# Altium project BatteryMonitor.PrjPCB
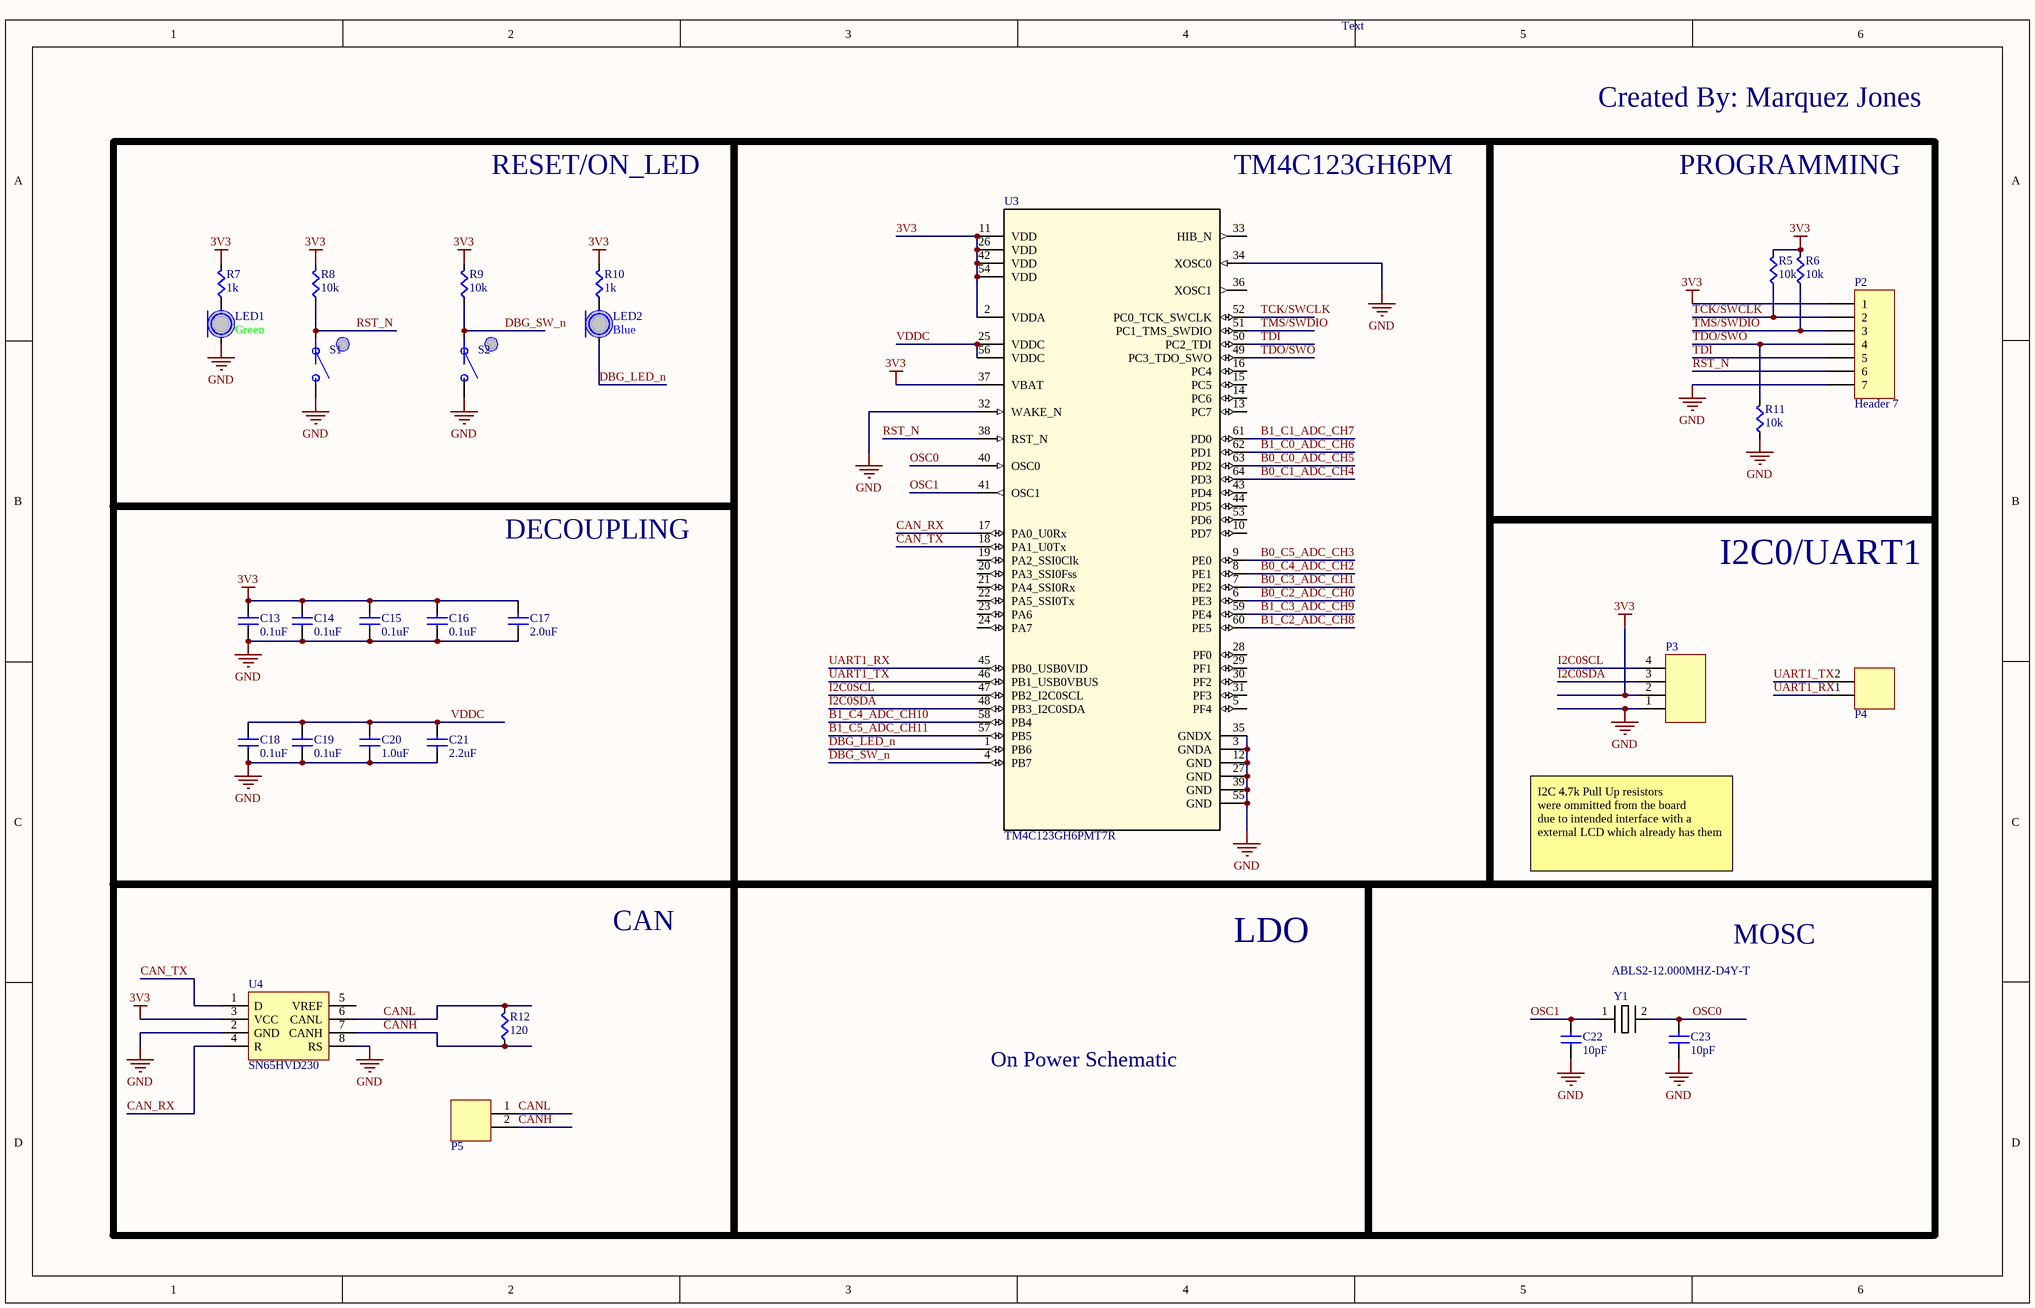
[diagram p0: Tiva_C_Base.SchDoc]
3 sheets, 106 parts. Net scope: global (net labels, ports and power ports of the same name join across sheets).
Board file: BattBoard.PcbDoc
Sheets:
  Tiva_C_Base.SchDoc
  Batt_Op_Amp.SchDoc
  Power.SchDoc

## Sheet Tiva_C_Base.SchDoc
size B

### Parts
C13  value 0.1uF  [CAPC0603]  (hidden comment: Cap)
C14  value 0.1uF  [CAPC0603]  (hidden comment: Cap)
C15  value 0.1uF  [CAPC0603]  (hidden comment: Cap)
C16  value 0.1uF  [CAPC0603]  (hidden comment: Cap)
C17  value 2.0uF  [CAPC0603]  (hidden comment: Cap)
C18  value 0.1uF  [CAPC0603]  (hidden comment: Cap)
C19  value 0.1uF  [CAPC0603]  (hidden comment: Cap)
C20  value 1.0uF  [CAPC0603]  (hidden comment: Cap)
C21  value 2.2uF  [CAPC0603]  (hidden comment: Cap)
C22  value 10pF  [CAPC0603]  (hidden comment: Cap)
C23  value 10pF  [CAPC0603]  (hidden comment: Cap)
LED1  Color: Green  [LED0603]  (hidden comment: LED)
LED2  Color: Blue  [LED0603]  (hidden comment: LED)
P2  Header 7  [HDR1X7]
P3  (no value)  [MOLEX-HDR-1X4-SHERLOCK-VERT]
P4  2-pin Vert Sherlock  [MOLEX-HDR-1X2-SHERLOCK-VERT]  (value not drawn)
P5  2-pin Vert Sherlock  [MOLEX-HDR-1X2-SHERLOCK-VERT]  (value not drawn)
R5  value 10k  [RES0603]  (hidden comment: Res)
R6  value 10k  [RES0603]  (hidden comment: Res)
R7  value 1k  [RES0603]  (hidden comment: Res)
R8  value 10k  [RES0603]  (hidden comment: Res)
R9  value 10k  [RES0603]  (hidden comment: Res)
R10  value 1k  [RES0603]  (hidden comment: Res)
R11  value 10k  [RES0603]  (hidden comment: Res)
R12  value 120  [RES0603]  (hidden comment: Res)
S1  Button  [PTS645xxxxSMTR92]  (value not drawn)
S2  Button  [PTS645xxxxSMTR92]  (value not drawn)
U3  TM4C123GH6PMT7R  [TM4C123GH6PMT7R_L]
U4  SN65HVD230  [SOIC-8pin]
Y1  ABLS2-12.000MHZ-D4Y-T  [HC49/US]

### Blocks framed on the sheet
RESET/ON_LED: LED1 LED2 R7-R10 S1 S2
TM4C123GH6PM: U3
PROGRAMMING: P2 R5 R6 R11
DECOUPLING: C13-C21
I2C0/UART1: P3 P4
CAN: P5 R12 U4
MOSC: C22 C23 Y1

### Nets
3V3: C13.1(A) C14.1(A) C15.1(A) C16.1(A) C17.1(A) P2.1 P3.2 R5.1(A) R6.1(A) R7.1(A) R8.1(A) R9.1(A) R10.1(A) U3.2(VDDA) U3.11(VDD) U3.26(VDD) U3.37(VBAT) U3.42(VDD) U3.54(VDD) U4.3(VCC)
GND: C13.2(B) C14.2(B) C15.2(B) C16.2(B) C17.2(B) C18.2(B) C19.2(B) C20.2(B) C21.2(B) C22.2(B) C23.2(B) LED1.C P2.7 P3.1 R11.2(B) S1.B S2.B U3.3(GNDA) U3.12(GND) U3.27(GND) U3.32(WAKE_N) U3.34(XOSC0) U3.35(GNDX) U3.39(GND) U3.55(GND) U4.2(GND) U4.8(RS)
B0_C0_ADC_CH5: U3.63(PD2)
B0_C1_ADC_CH4: U3.64(PD3)
B0_C2_ADC_CH0: U3.6(PE3)
B0_C3_ADC_CH1: U3.7(PE2)
B0_C4_ADC_CH2: U3.8(PE1)
B0_C5_ADC_CH3: U3.9(PE0)
B1_C0_ADC_CH6: U3.62(PD1)
B1_C1_ADC_CH7: U3.61(PD0)
B1_C2_ADC_CH8: U3.60(PE5)
B1_C3_ADC_CH9: U3.59(PE4)
B1_C4_ADC_CH10: U3.58(PB4)
B1_C5_ADC_CH11: U3.57(PB5)
CAN_RX: U3.17(PA0_U0Rx) U4.4(R)
CAN_TX: U3.18(PA1_U0Tx) U4.1(D)
CANH: P5.2 R12.2(B) U4.7(CANH)
CANL: P5.1 R12.1(A) U4.6(CANL)
DBG_LED_n: LED2.C U3.1(PB6)
DBG_SW_n: R9.2(B) S2.A U3.4(PB7)
I2C0SCL: P3.4 U3.47(PB2_I2C0SCL)
I2C0SDA: P3.3 U3.48(PB3_I2C0SDA)
OSC0: C23.1(A) U3.40(OSC0) Y1.2
OSC1: C22.1(A) U3.41(OSC1) Y1.1
RST_N: P2.6 R8.2(B) S1.A U3.38(RST_N)
TCK/SWCLK: P2.2 R5.2(B) U3.52(PC0_TCK_SWCLK)
TDI: P2.5 U3.50(PC2_TDI)
TDO/SWO: P2.4 R11.1(A) U3.49(PC3_TDO_SWO)
TMS/SWDIO: P2.3 R6.2(B) U3.51(PC1_TMS_SWDIO)
UART1_RX: P4.1 U3.45(PB0_USB0VID)
UART1_TX: P4.2 U3.46(PB1_USB0VBUS)
VDDC: C18.1(A) C19.1(A) C20.1(A) C21.1(A) U3.25(VDDC) U3.56(VDDC)
NetLED1_A: LED1.A R7.2(B)
NetLED2_A: LED2.A R10.2(B)

Not connected (* = marked no-connect by the designer): U3 5(PF4) 10(PD7) 13(PC7) 14(PC6) 15(PC5) 16(PC4) 19(PA2_SSI0Clk) 20(PA3_SSI0Fss) 21(PA4_SSI0Rx) 22(PA5_SSI0Tx) 23(PA6) 24(PA7) 28(PF0) 29(PF1) 30(PF2) 31(PF3) 33(HIB_N) 36(XOSC1) 43(PD4) 44(PD5) 53(PD6); U4 5(VREF)

### Notes on the sheet
- Text
- Created By: Marquez Jones
- I2C 4.7k Pull Up resistors
  were ommitted from the board
  due to intended interface with a
  external LCD which already has them
- LDO
- On Power Schematic

### Library data of the parts
P2 = Header 7: Header, 7-Pin; LatestRevisionDate: 17-Jul-2002; LatestRevisionNote: Re-released for DXP Platform.; Publisher: Altium Limited
P3 = MOLEX-HDR-1x4-SHERLOCK_VERT: Header, Molex, 2mm Pitch Sherlock Header, Single Row, Vertical, 4 Circuits, Length 3.3mm, 0353620450; Manufacturer Part Number: *; Order Part Number: *
P4 P5 = MOLEX-HDR-1x2-SHERLOCK_VERT: Header, Molex, 2mm Pitch Sherlock Header, Single Row, Vertical, 2 Circuits, Length 3.3mm, 0353620250; Manufacturer Part Number: *; Order Part Number: *
S1 S2 = Button: SPST Button; Supplier 1: Digi-Key; Supplier Part Number 1: CKN9087CT-ND
U3 = TM4C123GH6PMT7R: Imported; PartNumber: TM4C123GH6PMTR; Manufacturer: Texas Instruments; CompType: IC; PIN_COUNT: 64; Application_BuildNumber: *; Alternate_PartNumber: TM4C123GH6PMT; PackageReference: PM0064A; MountType: SMT; RoHS: Y; RefDes: RefDes; TYPE: TYPE; Value: Value
U4 = SN65HVD230: 3.3V CAN Bus Transceiver
Y1 = ABLS2-12.000MHZ-D4Y-T: 12MHz ±30ppm Crystal 18pF 50 Ohm -40°C ~ 85°C Surface Mount HC49/US; Supplier 1: Digi-Key; Supplier Part Number 1: 535-9869-1-ND
C13-C23 = Cap: Supplier 1: Digi-Key; Supplier Part Number 1: 1276-1000-1-ND
LED1 LED2 = LED: Supplier 1: Digi-Key; Supplier Part Number 1: 754-1122-1-ND
R5-R12 = Res: Supplier 1: Digi-Key; Supplier Part Number 1: RMCF0603JT10K0CT-ND

## Sheet Batt_Op_Amp.SchDoc
size C
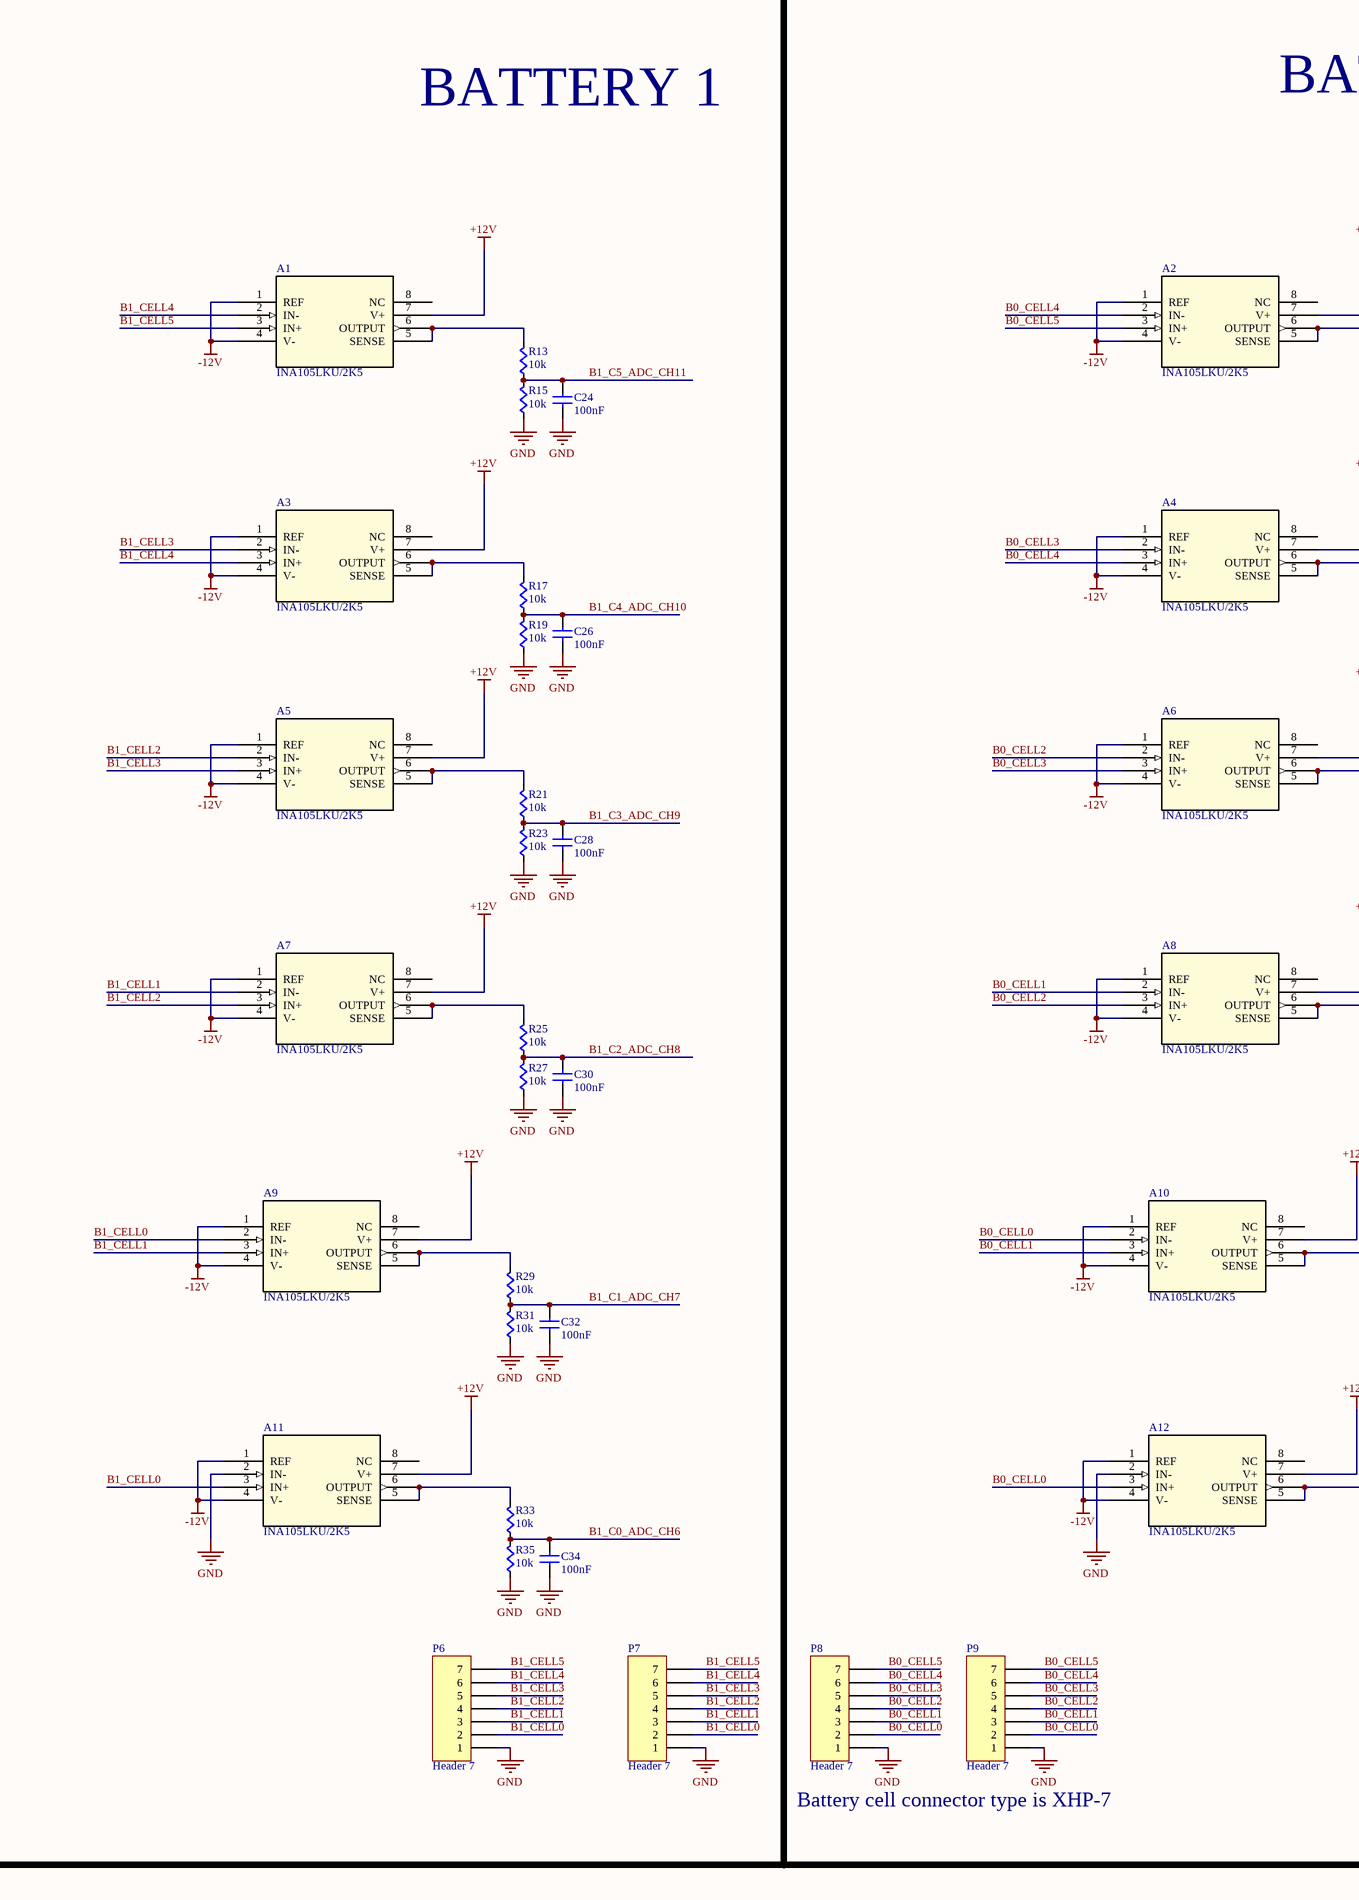
[diagram p1: Batt_Op_Amp.SchDoc, left]
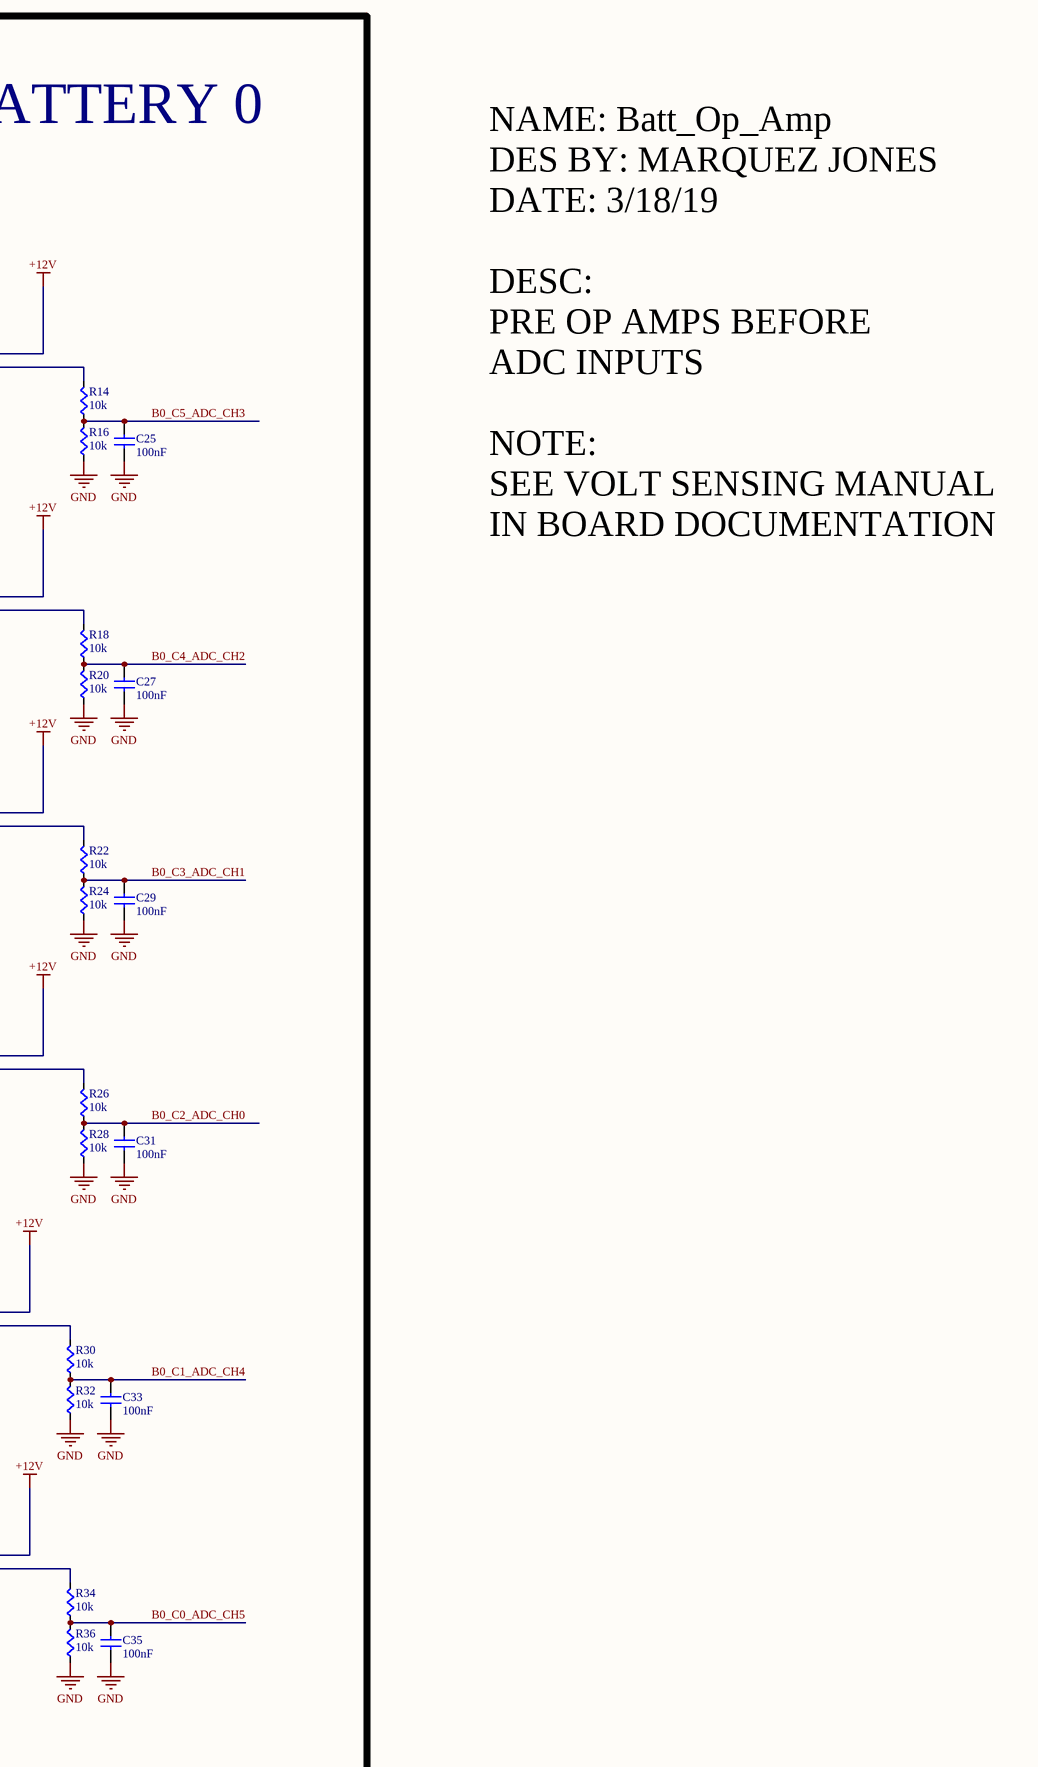
[diagram p2: Batt_Op_Amp.SchDoc, right]

### Parts
A1  INA105LKU/2K5  [SOIC-8N]
A2  INA105LKU/2K5  [SOIC-8N]
A3  INA105LKU/2K5  [SOIC-8N]
A4  INA105LKU/2K5  [SOIC-8N]
A5  INA105LKU/2K5  [SOIC-8N]
A6  INA105LKU/2K5  [SOIC-8N]
A7  INA105LKU/2K5  [SOIC-8N]
A8  INA105LKU/2K5  [SOIC-8N]
A9  INA105LKU/2K5  [SOIC-8N]
A10  INA105LKU/2K5  [SOIC-8N]
A11  INA105LKU/2K5  [SOIC-8N]
A12  INA105LKU/2K5  [SOIC-8N]
C24  value 100nF  [CAPC0603]  (hidden comment: Cap)
C25  value 100nF  [CAPC0603]  (hidden comment: Cap)
C26  value 100nF  [CAPC0603]  (hidden comment: Cap)
C27  value 100nF  [CAPC0603]  (hidden comment: Cap)
C28  value 100nF  [CAPC0603]  (hidden comment: Cap)
C29  value 100nF  [CAPC0603]  (hidden comment: Cap)
C30  value 100nF  [CAPC0603]  (hidden comment: Cap)
C31  value 100nF  [CAPC0603]  (hidden comment: Cap)
C32  value 100nF  [CAPC0603]  (hidden comment: Cap)
C33  value 100nF  [CAPC0603]  (hidden comment: Cap)
C34  value 100nF  [CAPC0603]  (hidden comment: Cap)
C35  value 100nF  [CAPC0603]  (hidden comment: Cap)
P6  Header 7  [HDR1X7]
P7  Header 7  [HDR1X7]
P8  Header 7  [HDR1X7]
P9  Header 7  [HDR1X7]
R13  value 10k  [RES0603]  (hidden comment: Res)
R14  value 10k  [RES0603]  (hidden comment: Res)
R15  value 10k  [RES0603]  (hidden comment: Res)
R16  value 10k  [RES0603]  (hidden comment: Res)
R17  value 10k  [RES0603]  (hidden comment: Res)
R18  value 10k  [RES0603]  (hidden comment: Res)
R19  value 10k  [RES0603]  (hidden comment: Res)
R20  value 10k  [RES0603]  (hidden comment: Res)
R21  value 10k  [RES0603]  (hidden comment: Res)
R22  value 10k  [RES0603]  (hidden comment: Res)
R23  value 10k  [RES0603]  (hidden comment: Res)
R24  value 10k  [RES0603]  (hidden comment: Res)
R25  value 10k  [RES0603]  (hidden comment: Res)
R26  value 10k  [RES0603]  (hidden comment: Res)
R27  value 10k  [RES0603]  (hidden comment: Res)
R28  value 10k  [RES0603]  (hidden comment: Res)
R29  value 10k  [RES0603]  (hidden comment: Res)
R30  value 10k  [RES0603]  (hidden comment: Res)
R31  value 10k  [RES0603]  (hidden comment: Res)
R32  value 10k  [RES0603]  (hidden comment: Res)
R33  value 10k  [RES0603]  (hidden comment: Res)
R34  value 10k  [RES0603]  (hidden comment: Res)
R35  value 10k  [RES0603]  (hidden comment: Res)
R36  value 10k  [RES0603]  (hidden comment: Res)

### Blocks framed on the sheet
BATTERY 1: A1 A3 A5 A7 A9 A11 C24 C26 C28 C30 C32 C34 P6 P7 R13 R15 R17 R19 R21 R23 R25 R27 R29 R31 R33 R35
BATTERY 0: A2 A4 A6 A8 A10 A12 C25 C27 C29 C31 C33 C35 P8 P9 R14 R16 R18 R20 R22 R24 R26 R28 R30 R32 R34 R36

### Nets
+12V: A1.7(V+) A2.7(V+) A3.7(V+) A4.7(V+) A5.7(V+) A6.7(V+) A7.7(V+) A8.7(V+) A9.7(V+) A10.7(V+) A11.7(V+) A12.7(V+)
-12V: A1.1(REF) A1.4(V-) A2.1(REF) A2.4(V-) A3.1(REF) A3.4(V-) A4.1(REF) A4.4(V-) A5.1(REF) A5.4(V-) A6.1(REF) A6.4(V-) A7.1(REF) A7.4(V-) A8.1(REF) A8.4(V-) A9.1(REF) A9.4(V-) A10.1(REF) A10.4(V-) A11.1(REF) A11.4(V-) A12.1(REF) A12.4(V-)
GND: A11.2(IN-) A12.2(IN-) C24.2(B) C25.2(B) C26.2(B) C27.2(B) C28.2(B) C29.2(B) C30.2(B) C31.2(B) C32.2(B) C33.2(B) C34.2(B) C35.2(B) P6.1 P7.1 P8.1 P9.1 R15.2(B) R16.2(B) R19.2(B) R20.2(B) R23.2(B) R24.2(B) R27.2(B) R28.2(B) R31.2(B) R32.2(B) R35.2(B) R36.2(B)
B0_C0_ADC_CH5: C35.1(A) R34.2(B) R36.1(A)
B0_C1_ADC_CH4: C33.1(A) R30.2(B) R32.1(A)
B0_C2_ADC_CH0: C31.1(A) R26.2(B) R28.1(A)
B0_C3_ADC_CH1: C29.1(A) R22.2(B) R24.1(A)
B0_C4_ADC_CH2: C27.1(A) R18.2(B) R20.1(A)
B0_C5_ADC_CH3: C25.1(A) R14.2(B) R16.1(A)
B0_CELL0: A10.2(IN-) A12.3(IN+) P8.2 P9.2
B0_CELL1: A8.2(IN-) A10.3(IN+) P8.3 P9.3
B0_CELL2: A6.2(IN-) A8.3(IN+) P8.4 P9.4
B0_CELL3: A4.2(IN-) A6.3(IN+) P8.5 P9.5
B0_CELL4: A2.2(IN-) A4.3(IN+) P8.6 P9.6
B0_CELL5: A2.3(IN+) P8.7 P9.7
B1_C0_ADC_CH6: C34.1(A) R33.2(B) R35.1(A)
B1_C1_ADC_CH7: C32.1(A) R29.2(B) R31.1(A)
B1_C2_ADC_CH8: C30.1(A) R25.2(B) R27.1(A)
B1_C3_ADC_CH9: C28.1(A) R21.2(B) R23.1(A)
B1_C4_ADC_CH10: C26.1(A) R17.2(B) R19.1(A)
B1_C5_ADC_CH11: C24.1(A) R13.2(B) R15.1(A)
B1_CELL0: A9.2(IN-) A11.3(IN+) P6.2 P7.2
B1_CELL1: A7.2(IN-) A9.3(IN+) P6.3 P7.3
B1_CELL2: A5.2(IN-) A7.3(IN+) P6.4 P7.4
B1_CELL3: A3.2(IN-) A5.3(IN+) P6.5 P7.5
B1_CELL4: A1.2(IN-) A3.3(IN+) P6.6 P7.6
B1_CELL5: A1.3(IN+) P6.7 P7.7
NetA1_5: A1.5(SENSE) A1.6(OUTPUT) R13.1(A)
NetA2_5: A2.5(SENSE) A2.6(OUTPUT) R14.1(A)
NetA3_5: A3.5(SENSE) A3.6(OUTPUT) R17.1(A)
NetA4_5: A4.5(SENSE) A4.6(OUTPUT) R18.1(A)
NetA5_5: A5.5(SENSE) A5.6(OUTPUT) R21.1(A)
NetA6_5: A6.5(SENSE) A6.6(OUTPUT) R22.1(A)
NetA7_5: A7.5(SENSE) A7.6(OUTPUT) R25.1(A)
NetA8_5: A8.5(SENSE) A8.6(OUTPUT) R26.1(A)
NetA9_5: A9.5(SENSE) A9.6(OUTPUT) R29.1(A)
NetA10_5: A10.5(SENSE) A10.6(OUTPUT) R30.1(A)
NetA11_5: A11.5(SENSE) A11.6(OUTPUT) R33.1(A)
NetA12_5: A12.5(SENSE) A12.6(OUTPUT) R34.1(A)

Not connected (* = marked no-connect by the designer): A1 8(NC); A2 8(NC); A3 8(NC); A4 8(NC); A5 8(NC); A6 8(NC); A7 8(NC); A8 8(NC); A9 8(NC); A10 8(NC); A11 8(NC); A12 8(NC)

### Notes on the sheet
- NAME: Batt_Op_Amp
  DES BY: MARQUEZ JONES
  DATE: 3/18/19
  DESC:
  PRE OP AMPS BEFORE
  ADC INPUTS
  NOTE:
  SEE VOLT SENSING MANUAL
  IN BOARD DOCUMENTATION
- Battery cell connector type is XHP-7

### Library data of the parts
P6-P9 = Header 7: Header, 7-Pin; LatestRevisionDate: 17-Jul-2002; LatestRevisionNote: Re-released for DXP Platform.; Publisher: Altium Limited
C24-C35 = Cap: Supplier 1: Digi-Key; Supplier Part Number 1: 1276-1000-1-ND
R13-R36 = Res: Supplier 1: Digi-Key; Supplier Part Number 1: RMCF0603JT10K0CT-ND

## Sheet Power.SchDoc
size A
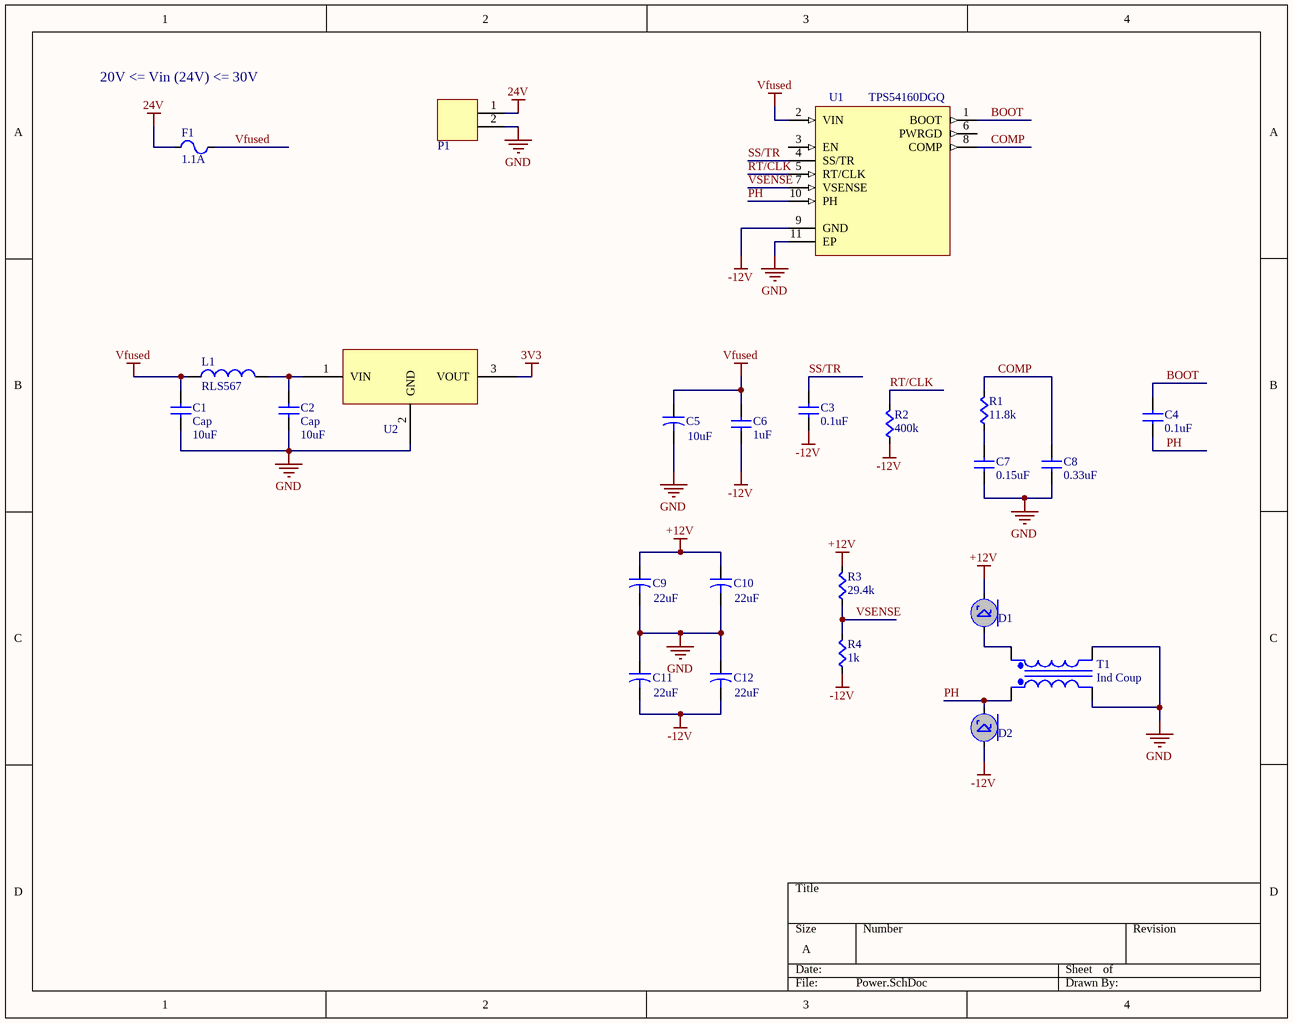
[diagram p3: Power.SchDoc]

### Parts
C1  Cap  value 10uF  [CAP1210]
C2  Cap  value 10uF  [CAP1210]
C3  value 0.1uF  [CAPC0603]  (hidden comment: EEHZA1H101P)
C4  value 0.1uF  [CAPC0603]  (hidden comment: Cap)
C5  value 10uF  [CAPR5-4X5]  (hidden comment: Cap2)
C6  value 1uF  [CAPC0603]  (hidden comment: Cap)
C7  value 0.15uF  [CAPC0603]  (hidden comment: Cap)
C8  value 0.33uF  [CAPC0603]  (hidden comment: Cap)
C9  value 22uF  [CAPR5-4X5]  (hidden comment: Cap2)
C10  value 22uF  [CAPR5-4X5]  (hidden comment: Cap2)
C11  value 22uF  [CAPR5-4X5]  (hidden comment: Cap2)
C12  value 22uF  [CAPR5-4X5]  (hidden comment: Cap2)
D1  Schottky  [DSS16UTR]  (value not drawn)
D2  Schottky  [DSS16UTR]  (value not drawn)
F1  value 1.1A  [PTC7451X11N]  (hidden comment: PTC Fuse)
L1  Inductor  [RLS567]  (value not drawn)
P1  2-pin Vert Sherlock  [MOLEX-HDR-1X2-SHERLOCK-VERT]  (value not drawn)
R1  value 11.8k  [RES1206]  (hidden comment: Res)
R2  value 400k  [RES1206]  (hidden comment: Res)
R3  value 29.4k  [RES1206]  (hidden comment: Res)
R4  value 1k  [RES0603]  (hidden comment: Res)
T1  Ind Coup  [SOP4]
U1  TPS54160DGQ  [SOIC-11]
U2  R-78C3.3-1.0  [R-78C3.3-1.0]  (value not drawn)

### Nets
3V3: U2.3(VOUT)
24V: F1.1(A) P1.1
+12V: C9.1 C10.1 D1.C R3.1(A)
-12V: C3.2(B) C6.2(B) C11.2 C12.2 D2.A R2.2(B) R4.2(B) U1.9(GND)
GND: C1.2(B) C2.2(B) C5.2 C7.2(B) C8.2(B) C9.2 C10.2 C11.1 C12.1 P1.2 T1.1(Pri-) T1.2(Sec-) U1.11(EP) U2.2(GND)
Vfused: C1.1(A) C5.1 C6.1(A) F1.2(B) L1.1(A) U1.2(VIN)
BOOT: C4.1(A) U1.1(BOOT)
COMP: C8.1(A) R1.1(A) U1.8(COMP)
PH: C4.2(B) D2.C T1.4(Pri+) U1.10(PH)
RT/CLK: R2.1(A) U1.5(RT/CLK)
SS/TR: C3.1(A) U1.4(SS/TR)
VSENSE: R3.2(B) R4.1(A) U1.7(VSENSE)
NetC2_1: C2.1(A) L1.2(B) U2.1(VIN)
NetC7_1: C7.1(A) R1.2(B)
NetD1_A: D1.A T1.3(Sec+)

Not connected (* = marked no-connect by the designer): U1 3(EN) 6(PWRGD)

### Notes on the sheet
- 20V <= Vin (24V) <= 30V

### Library data of the parts
C1 C2 = CAP1210: CAP CER 10UF 50V 20% X5R 1210; Supplier 1: Digi-Key; Supplier Part Number 1: 587-2225-1-ND
C3 = Cap: Supplier 1: Digi-Key; Supplier Part Number 1: 1276-1000-1-ND
C5 C9-C12 = Cap2: Capacitor; Published: 23-Sep-2002; PackageReference: CAPR5-4X5; Publisher: Altium Limited; PackageDescription: Capacitor; 2 Leads
D1 D2 = Schottky: Schottky Diode Template
F1 = PTC_Fuse: Supplier 1: Digi-Key; Supplier Part Number 1: 507-1744-1-ND
P1 = MOLEX-HDR-1x2-SHERLOCK_VERT: as P4 on sheet Tiva_C_Base; Manufacturer Part Number: *; Order Part Number: *
T1 = Trans Cupl: Transformer (Coupled Inductor Model); Published: 8-Jun-2000; LatestRevisionDate: 17-Jul-2002; LatestRevisionNote: Re-released for DXP Platform.; PackageReference: TRF_4; Publisher: Altium Limited; PackageDescription: Transformer; 4 Leads
U1 = TPS54160DGQ: Buck Switching Regulator IC Positive Adjustable 0.8V 1 Output 1.5A 10-TFSOP, 10-MSOP _0.118, 3.00mm Width_ Exposed Pad; MF: Texas Instruments; Availability: Unavailable; Package: TFSOP-10 Texas Instruments; SnapEDA_Link: https://www.snapeda.com/parts/TPS54160DGQ/Texas%20Instruments/view-part/393939/?ref=snap; Price: None; Value: *; MP: TPS54160DGQ
U2 = R-78C3.3-1.0: CONV DC/DC 1A 3.3V OUT SIP VERT; Supplier 1: Digi-Key; Supplier Part Number 1: 945-1394-5-ND
C4 C6-C8 = Cap: Supplier 1: Digi-Key; Supplier Part Number 1: 1276-1000-1-ND
L1 = Inductor: Supplier 1: Digi-Key; Supplier Part Number 1: ?; Inductance: RLS567
R1-R4 = Res: Supplier 1: Digi-Key; Supplier Part Number 1: RMCF0603JT10K0CT-ND

## Nets that join several sheets
3V3: Tiva_C_Base (20 pins), Power (U2.3)
+12V: Batt_Op_Amp (12 pins), Power (C9.1 C10.1 D1.C R3.1)
-12V: Batt_Op_Amp (24 pins), Power (8 pins)
GND: Tiva_C_Base (27 pins), Batt_Op_Amp (30 pins), Power (14 pins)
B0_C0_ADC_CH5: Tiva_C_Base (U3.63), Batt_Op_Amp (C35.1 R34.2 R36.1)
B0_C1_ADC_CH4: Tiva_C_Base (U3.64), Batt_Op_Amp (C33.1 R30.2 R32.1)
B0_C2_ADC_CH0: Tiva_C_Base (U3.6), Batt_Op_Amp (C31.1 R26.2 R28.1)
B0_C3_ADC_CH1: Tiva_C_Base (U3.7), Batt_Op_Amp (C29.1 R22.2 R24.1)
B0_C4_ADC_CH2: Tiva_C_Base (U3.8), Batt_Op_Amp (C27.1 R18.2 R20.1)
B0_C5_ADC_CH3: Tiva_C_Base (U3.9), Batt_Op_Amp (C25.1 R14.2 R16.1)
B1_C0_ADC_CH6: Tiva_C_Base (U3.62), Batt_Op_Amp (C34.1 R33.2 R35.1)
B1_C1_ADC_CH7: Tiva_C_Base (U3.61), Batt_Op_Amp (C32.1 R29.2 R31.1)
B1_C2_ADC_CH8: Tiva_C_Base (U3.60), Batt_Op_Amp (C30.1 R25.2 R27.1)
B1_C3_ADC_CH9: Tiva_C_Base (U3.59), Batt_Op_Amp (C28.1 R21.2 R23.1)
B1_C4_ADC_CH10: Tiva_C_Base (U3.58), Batt_Op_Amp (C26.1 R17.2 R19.1)
B1_C5_ADC_CH11: Tiva_C_Base (U3.57), Batt_Op_Amp (C24.1 R13.2 R15.1)